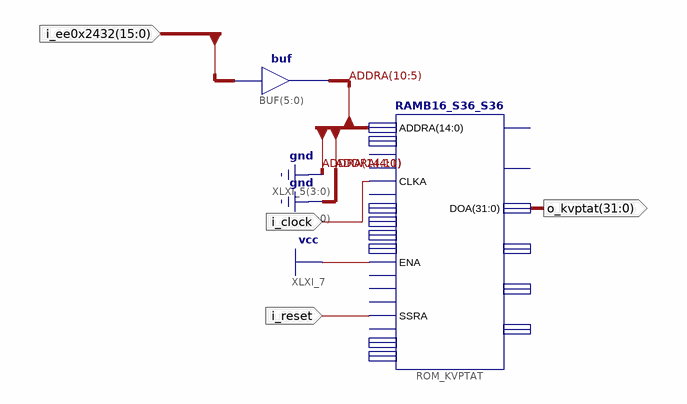
[diagram p0: schematic sheet 1]
// Xilinx ISE schematic ExtractKvPTATParameter.sch (spartan3e) as structural Verilog: 2 symbols, 4 ports
module ExtractKvPTATParameter (
  input  [15:0] i_ee0x2432,
  input  i_clock,
  input  i_reset,
  output [31:0] o_kvptat
);

  wire [10:5] ADDRA;

  RAMB16_S36_S36 #(.INIT_07("b9800000ba000000ba400000ba800000baa00000bac00000bae00000bb000000"), .INIT_06("bb100000bb200000bb300000bb400000bb500000bb600000bb700000bb800000"), .INIT_05("bb880000bb900000bb980000bba00000bba80000bbb00000bbb80000bbc00000"), .INIT_04("bbc80000bbd00000bbd80000bbe00000bbe80000bbf00000bbf80000bc000000"), .INIT_03("3bf800003bf000003be800003be000003bd800003bd000003bc800003bc00000"), .INIT_02("3bb800003bb000003ba800003ba000003b9800003b9000003b8800003b800000"), .INIT_01("3b7000003b6000003b5000003b4000003b3000003b2000003b1000003b000000"), .INIT_00("3ae000003ac000003aa000003a8000003a4000003a0000003980000022000000"), .WRITE_WIDTH_B(36), .WRITE_WIDTH_A(36), .WRITE_MODE_B("READ_FIRST"), .WRITE_MODE_A("READ_FIRST"), .READ_WIDTH_B(36), .READ_WIDTH_A(36)) ROM_KVPTAT (
    .ADDRA({4'b0000, ADDRA, {5{1'b0}}}), .CLKA(i_clock), .ENA(1'b1), .SSRA(i_reset), .DOA(o_kvptat));  // open: ADDRB, CASCADEINA, CASCADEINB, CLKB, DIA, DIB, DIPA, DIPB, REGCEA, REGCEB, ENB, SSRB, WEA, WEB, CASCADEOUTA, CASCADEOUTB, DOB, DOPA, DOPB
  assign ADDRA = i_ee0x2432[15:10];  // buf BUF[5..0], 6 bits wide
endmodule
